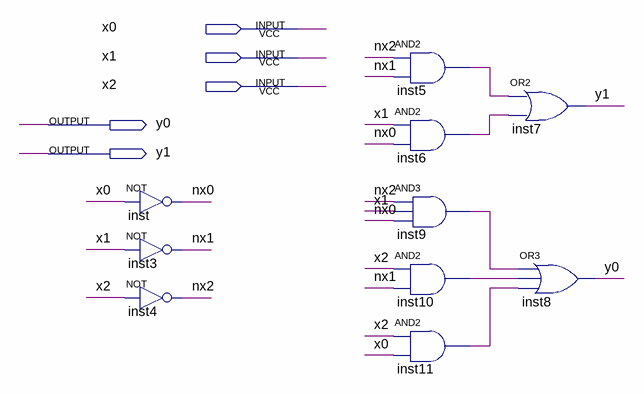
[diagram p0: schematic sheet]
// Quartus schematic lab.bdf as structural Verilog: 10 symbols, 5 pins
module lab (
  input  x0,
  input  x1,
  input  x2,
  output y0,
  output y1
);

  wire inst5_out, inst6_out, inst9_out, inst10_out, inst11_out, nx0, nx1, nx2;

  not inst (nx0, x0);
  not inst3 (nx1, x1);
  not inst4 (nx2, x2);
  and inst5 (inst5_out, nx2, nx1);
  and inst6 (inst6_out, x1, nx0);
  and inst9 (inst9_out, nx2, x1, nx0);
  and inst10 (inst10_out, x2, nx1);
  and inst11 (inst11_out, x2, x0);
  or inst7 (y1, inst5_out, inst6_out);
  or inst8 (y0, inst9_out, inst10_out, inst11_out);
endmodule
